# Altium schematic sheet Rail_Shutdown_AD.SchDoc
size A4; SheetNumber: 20
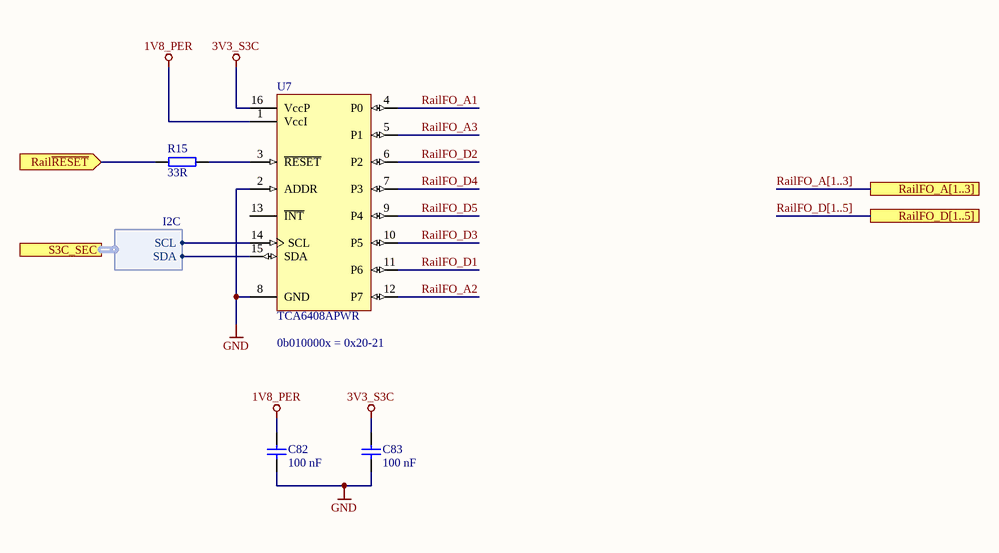
[diagram p0: Rail_Shutdown_AD.SchDoc]

## Parts
C82  100 nF  [C_0603_TE]
C83  100 nF  [C_0603_TE]
R15  33R  [R_0603_TE]
U7  TCA6408APWR  [TSSOP-16_PW0016A_N]

## Ports
RailFO_A[1..3], RailFO_D[1..5], Rail~{RESET} (in), S3C_SEC (harness I2C)

## Harnesses
I2C: SCL, SDA

## Nets
1V8_PER: C82.1 U7.1(VccI)
3V3_S3C: C83.1 U7.16(VccP)
GND: C82.2 C83.2 U7.2(ADDR) U7.8(GND)
RailFO_A1: U7.4(P0)
RailFO_A2: U7.12(P7)
RailFO_A3: U7.5(P1)
RailFO_D1: U7.11(P6)
RailFO_D2: U7.6(P2)
RailFO_D3: U7.10(P5)
RailFO_D4: U7.7(P3)
RailFO_D5: U7.9(P4)
Rail~{RESET}: R15.1 ; port Rail~{RESET}
NetR15_2: R15.2 U7.3(~{RESET})
NetU7_14: U7.14(SCL) ; port S3C_SEC.SCL
NetU7_15: U7.15(SDA) ; port S3C_SEC.SDA

Not connected (* = marked no-connect by the designer): U7 13(~{INT})

## Buses and harness runs
bus RailFO_A[1..3] = port RailFO_A[1..3]
bus RailFO_D[1..5] = port RailFO_D[1..5]

## Notes on the sheet
- (near U7) 0b010000x = 0x20-21
- Title
- Revision:
- Design Engineer:
- Date:
- Project:
- Sheet
- of

## Library data of the parts
C82 C83 = UZgen_C_0603_100nF_50V_X7R: Generic capacitor; Manufacturer: UZgen; Voltage: 50V; Tolerance: 10 %; Created from: AGeiger; Manufacturer Part Number: UZgen_C_0603_100nF_50V_X7R; PartID: 1; Created On: 02/07/2024 14:42:23; Value: 100 nF; Device Package: 0603; Technology: X7R; Mounting Type: SMD; Last Updated: 08/08/2024 15:01:15
R15 = UZgen_R_0603_33R: Generic resistor; Manufacturer: UZgen; Tolerance: 1 %; Created from: UZgenTool; Manufacturer Part Number: UZgen_R_0603_33R; PartID: 185; Created On: 02/07/2024 17:29:48; Value: 33R; Device Package: 0603; Mounting Type: SMD; Last Updated: 02/07/2024 17:29:48
U7 = TCA6408APWR: Low-Voltage 8-Bit I²C and SMBus I/O Expander With Interrupt Output, Reset, and Configuration Registers; Manufacturer: Texas Instruments; Created from: MGeier; Manufacturer Part Number: TCA6408APWR; PartID: 8; Created On: 17/07/2025 17:45:00; ComponentLink1Description: Datasheet; ComponentLink1URL: https://www.ti.com/lit/ds/symlink/tca6408a.pdf; Component Type: I²C-IO-Expander; Device Package: TSSOP-16; Last Updated: 17/07/2025 17:45:00; Mounting Type: SMD; Supplier 1: LCSC; Supplier Part Number 1: C206177; Type: I²C IO Expander; Live Cycle Status: 1; LCSC Part Number: C206177; Stock number: not stored